# EAGLE design MLS01-TG000-C09 (EAGLE 9.6.2)
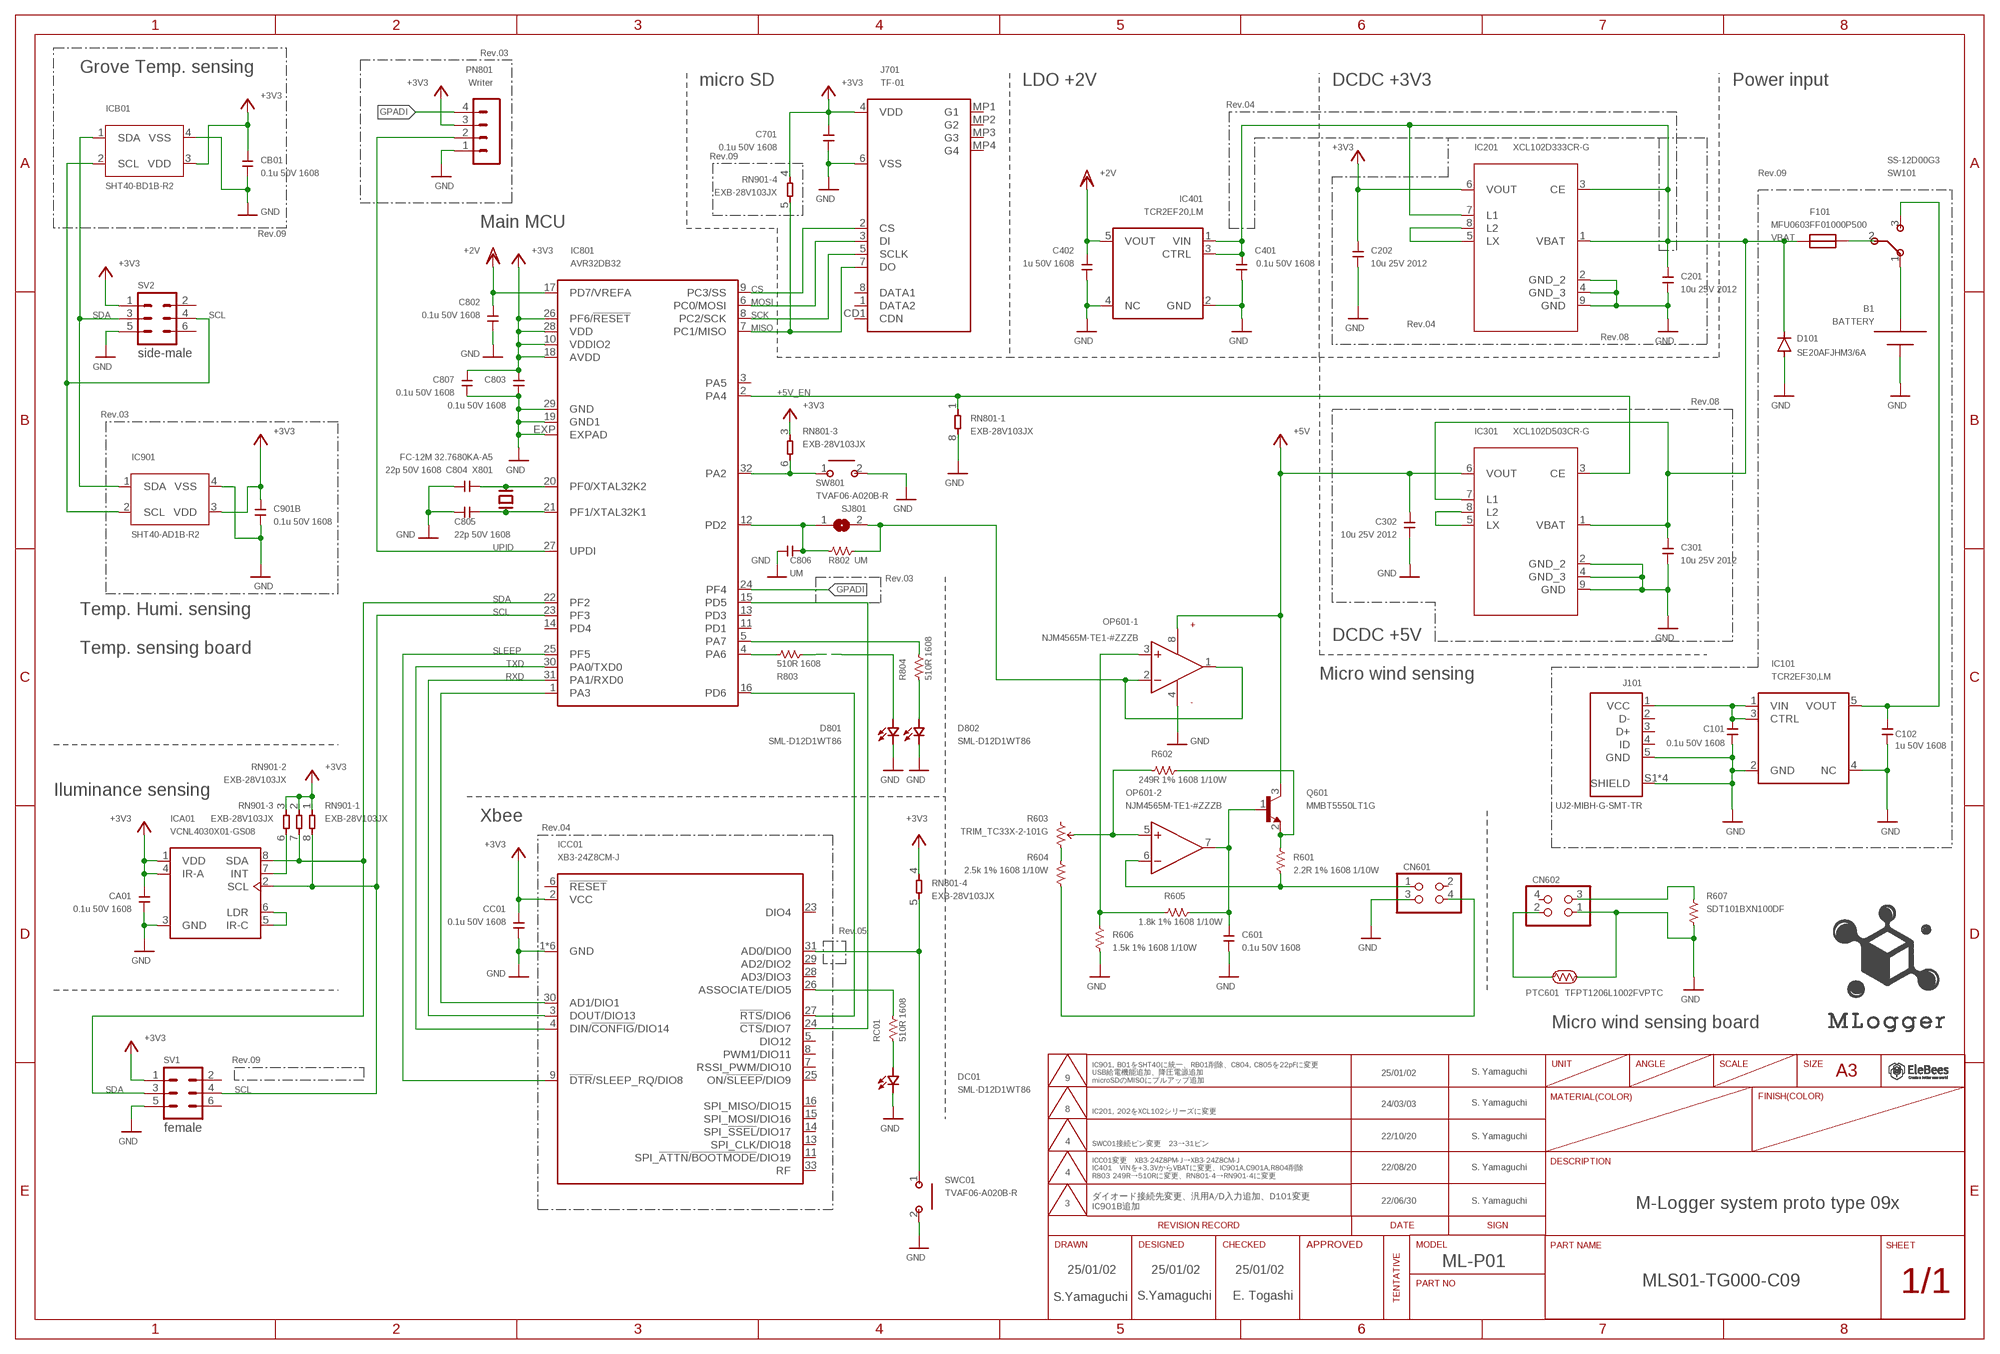
[diagram p0: schematic, sheet 1]

## Parts
B1  BATTERY  [PAD]
C101  0.1u 50V 1608  CL10A105KP8NNNC  [C-1608/0603]
C102  1u 50V 1608  CL10A105KP8NNNC  [C-1608/0603]
C201  10u 25V 2012  CL21B105KBFNNNG  [C-2012/0805]
C202  10u 25V 2012  CL21B105KBFNNNG  [C-2012/0805]
C301  10u 25V 2012  CL21B105KBFNNNG  [C-2012/0805]
C302  10u 25V 2012  CL21B105KBFNNNG  [C-2012/0805]
C401  0.1u 50V 1608  CL10A105KP8NNNC  [C-1608/0603]
C402  1u 50V 1608  CL10A105KP8NNNC  [C-1608/0603]
C601  0.1u 50V 1608  CL10A105KP8NNNC  [C-1608/0603]
C701  0.1u 50V 1608  CL10A105KP8NNNC  [C-1608/0603]
C802  0.1u 50V 1608  CL10A105KP8NNNC  [C-1608/0603]
C803  0.1u 50V 1608  CL10A105KP8NNNC  [C-1608/0603]
C804  22p 50V 1608  CL10A105KP8NNNC  [C-1608/0603]
C805  22p 50V 1608  CL10A105KP8NNNC  [C-1608/0603]
C806  UM  CL10A105KP8NNNC  [C-1608/0603]
C807  0.1u 50V 1608  CL10A105KP8NNNC  [C-1608/0603]
C901B  0.1u 50V 1608  CL10A105KP8NNNC  [C-1608/0603]
CA01  0.1u 50V 1608  CL10A105KP8NNNC  [C-1608/0603]
CB01  0.1u 50V 1608  CL10A105KP8NNNC  [C-1608/0603]
CC01  0.1u 50V 1608  CL10A105KP8NNNC  [C-1608/0603]
CN601  PINHD-2X2  [2X02]
CN602  PINHD-2X2  [2X02]
D101  SE20AFJHM3/6A  GS2JFL-TP  [SODFL5629X125N]
D801  SML-D12D1WT86  [SMD-1608]
D802  SML-D12D1WT86  [SMD-1608]
DC01  SML-D12D1WT86  [SMD-1608]
F101  MFU0603FF01000P500  [FUSC1608X60N]
IC101  TCR2EF30,LM  TCR2EF20,LM  [SOT23-5L]
IC201  XCL102D333CR-G  XCL102D503CR-GCL-2025-02_TOR  [CL-2025-02_TOR]
IC301  XCL102D503CR-G  XCL102D503CR-GCL-2025-02_TOR  [CL-2025-02_TOR]
IC401  TCR2EF20,LM  [SOT23-5L]
IC801  AVR32DB32  [HVQFN32]
IC901  SHT40-AD1B-R2  SHT41  [SHT41]
ICA01  VCNL4030X01-GS08  [VISHAY_VCNL4030X01-GS08]
ICB01  SHT40-BD1B-R2  SHT41  [SHT41]
ICC01  XB3-24Z8CM-J  [XCVR_XB3-24Z8CM-J]
J101  UJ2-MIBH-G-SMT-TR  [CUI_UJ2-MIBH-G-SMT-TR]
J701  TF-01  [TF-01A]
OP601  NJM4565M-TE1-#ZZZB  [SOIC127P680X175-8N]
PN801  Writer  MA04-1  [MA04-1]
PTC601  TFPT1206L1002FVPTC  [C1206]
Q601  MMBT5550LT1G  [SOT95P237X111-3N]
R601  2.2R 1% 1608 1/10W  R-1608  [R-1608/0603]
R602  249R 1% 1608 1/10W  R-1608  [R-1608/0603]
R603  TRIM_TC33X-2-101G  [TRIM_TC33X-2-101G]
R604  2.5k 1% 1608 1/10W  R-1608  [R-1608/0603]
R605  1.8k 1% 1608 1/10W  R-1608  [R-1608/0603]
R606  1.5k 1% 1608 1/10W  R-1608  [R-1608/0603]
R607  SDT101BXN100DF  [SDT101BXN100DF]
R802  UM  R-1608  [R-1608/0603]
R803  510R 1608  R-1608  [R-1608/0603]
R804  510R 1608  R-1608  [R-1608/0603]
RC01  510R 1608  R-1608  [R-1608/0603]
RN801  EXB-28V103JX  [RESCAXS50P200X100X45-8N]
RN901  EXB-28V103JX  [RESCAXS50P200X100X45-8N]
SJ801  SJ  [SJ]
SV1  female  MA03-2-FEMALE  [MA03-2-FEMALE]
SV2  side-male  MA03-2-SIDE-MALE  [MA03-2-SIDE-MALE]
SW101  SS-12D00G3  [SS-12D00G3]
SW801  TVAF06-A020B-R  [TVAF06-A020B-R]
SWC01  TVAF06-A020B-R  [TVAF06-A020B-R]
U$4  ELEBEES_SMALL  [ELEBEES_SMALL]
X801  FC-12M 32.7680KA-A5  SMD-CRYSTAL-32.768KHZ-12.5PF-20PPM-90K(2P-L2.0X1.2MM)  [X2-SMD-L2.0X1.2X0.55MM]

## Nets
+2V [PWR]: C402.P$1 C802.P$1 IC401.5(VOUT) IC801.17(PD7/VREFA)
+3V3: C202.P$2 C701.P$1 C803.P$1 C807.P$1 C901B.P$1 CA01.P$1 CB01.P$1 CC01.P$1 IC201.6(VOUT) IC801.10(VDDIO2) IC801.18(AVDD) IC801.26(PF6/!RESET) IC801.28(VDD) IC901.3(VDD) ICA01.1(VDD) ICA01.4(IR-A) ICB01.3(VDD) ICC01.2(VCC) J701.4(VDD) PN801.3 RN801.3 RN801.4 RN901.1 RN901.2 RN901.3 RN901.4 SV1.1 SV2.1
+5V: C302.P$2 IC301.6(VOUT) OP601.8(-1:V+) Q601.3(C)
+5V_EN: IC301.3(CE) IC801.2(PA4) RN801.1
BAT: B1.1(+) SW101.1
CS: IC801.9(PC3/SS) J701.2(CS)
GND: B1.2(-) C101.P$2 C102.P$2 C201.P$1 C202.P$1 C301.P$1 C302.P$1 C401.P$2 C402.P$2 C601.P$2 C701.P$2 C802.P$2 C803.P$2 C804.P$2 C805.P$2 C806.P$2 C807.P$2 C901B.P$2 CA01.P$2 CB01.P$2 CC01.P$2 CN601.3 CN602.1 D101.2(A) D801.2(C) D802.2(C) DC01.2(C) IC101.2(GND) IC101.4(NC) IC201.2(GND_2) IC201.4(GND_3) IC201.9(GND) IC301.2(GND_2) IC301.4(GND_3) IC301.9(GND) IC401.2(GND) IC401.4(NC) IC801.19(GND1) IC801.29(GND) IC801.EXP(EXPAD) IC901.4(VSS) ICA01.3(GND) ICB01.4(VSS) ICC01.1(GND) ICC01.10(GND) ICC01.12(GND) ICC01.21(GND) ICC01.32(GND) ICC01.34(GND) J101.5(GND) J101.S1(SHIELD) J101.S2(SHIELD) J101.S3(SHIELD) J101.S4(SHIELD) J701.6(VSS) OP601.4(-1:V-) PN801.1 PTC601.1 R606.1 R607.1 RN801.8 SV1.5 SV2.5 SW801.2 SWC01.2
GPADI: IC801.24(PF4) PN801.4
MISO: IC801.7(PC1/MISO) J701.7(DO) RN901.5
MOSI: IC801.6(PC0/MOSI) J701.3(DI)
N$1: F101.1 SW101.2
N$3: CN601.4 CN602.2 PTC601.2 R604.1
N$6: IC201.5(LX) IC201.8(L2)
N$8: IC301.5(LX) IC301.8(L2)
N$9: IC801.5(PA7) R804.2
N$10: D802.1(A) R804.1
N$11: OP601.1(-1:OUT) OP601.2(-1:-IN) R802.2 SJ801.2
N$12: ICC01.26(ASSOCIATE/DIO5) RC01.2
N$13: DC01.1(A) RC01.1
N$15: OP601.3(-1:+IN) R605.1 R606.2
N$16: OP601.5(-2:+IN) R602.1 R603.2
N$17: R603.3 R604.2
N$18: IC801.4(PA6) R803.1
N$19: C601.P$1 OP601.7(-2:OUT) Q601.1(B) R605.2
N$20: CN601.1 CN602.3 OP601.6(-2:-IN) R601.1 R607.2
N$21: IC801.1(PA3) ICC01.30(AD1/DIO1)
N$22: IC801.15(PD5) ICC01.24(!CTS!/DIO7)
N$23: IC801.16(PD6) ICC01.27(!RTS!/DIO6)
N$24: C101.P$1 IC101.1(VIN) IC101.3(CTRL) J101.1(VCC)
N$25: C806.P$1 IC801.12(PD2) R802.1 SJ801.1
N$30: Q601.2(E) R601.2 R602.2
N$31: ICA01.7(INT) RN901.6
N$39: D801.1(A) R803.2
N$49: IC801.32(PA2) RN801.6 SW801.1
N$50: C804.P$1 IC801.20(PF0/XTAL32K2) X801.1
N$51: C805.P$1 IC801.21(PF1/XTAL32K1) X801.2
N$56: ICC01.31(AD0/DIO0) RN801.5 SWC01.1
N$57: ICA01.5(IR-C) ICA01.6(LDR)
RXD: IC801.31(PA1/RXD0) ICC01.3(DOUT/DIO13)
SCK: IC801.8(PC2/SCK) J701.5(SCLK)
SCL: IC801.23(PF3) IC901.2(SCL) ICA01.2(SCL) ICB01.2(SCL) RN901.8 SV1.4 SV2.4
SDA: IC801.22(PF2) IC901.1(SDA) ICA01.8(SDA) ICB01.1(SDA) RN901.7 SV1.3 SV2.3
SLEEP: IC801.25(PF5) ICC01.9(!DTR!/SLEEP_RQ/DIO8)
TXD: IC801.30(PA0/TXD0) ICC01.4(DIN/!CONFIG!/DIO14)
UPID: IC801.27(UPDI) PN801.2
USB: C102.P$1 IC101.5(VOUT) SW101.3
VBAT: C201.P$2 C301.P$2 C401.P$1 D101.1(C) F101.2 IC201.1(VBAT) IC201.3(CE) IC201.7(L1) IC301.1(VBAT) IC301.7(L1) IC401.1(VIN) IC401.3(CTRL)
Unconnected: CN601.2 CN602.4 IC801.3(PA5) IC801.11(PD1) IC801.13(PD3) IC801.14(PD4) ICC01.5(DIO12) ICC01.6(!RESET) ICC01.7(RSSI_PWM/DIO10) ICC01.8(PWM1/DIO11) ICC01.11(SPI_!ATTN!/!BOOTMODE!/DIO19) ICC01.13(SPI_CLK/DIO18) ICC01.14(SPI_!SSEL!/DIO17) ICC01.15(SPI_MOSI/DIO16) ICC01.16(SPI_MISO/DIO15) ICC01.23(DIO4) ICC01.25(ON/!SLEEP!/DIO9) ICC01.28(AD3/DIO3) ICC01.29(AD2/DIO2) ICC01.33(RF) J101.2(D-) J101.3(D+) J101.4(ID) J701.1(DATA2) J701.8(DATA1) J701.CD1(CDN) J701.MP1(G1) J701.MP2(G2) J701.MP3(G3) J701.MP4(G4) R603.1 RN801.2 RN801.7 SV1.2 SV1.6 SV2.2 SV2.6

## Notes on the sheet
- Rev.03
- Grove Temp. sensing
- micro SD | LDO +2V | DCDC +3V3 | Power input
- Rev.04
- Rev.09
- Rev.09
- Main MCU
- Rev.09
- Rev.04
- Rev.08
- Rev.08
- Rev.03
- Rev.03
- Temp. Humi. sensing
- DCDC +5V
- Temp. sensing board
- Micro wind sensing
- Iluminance sensing
- Xbee
- Rev.04
- Rev.05
- Micro wind sensing board
- Rev.09
- 25/01/02 | S. Yamaguchi
- 9
- IC901, B01をSHT40に統一、RB01削除、C804, C805を22pFに変更
  USB給電機能追加、降圧電源追加
  microSDのMISOにプルアップ追加
- 24/03/03 | S. Yamaguchi
- 8 | IC201, 202をXCL102シリーズに変更
- 22/10/20 | S. Yamaguchi
- 4 | SWC01接続ピン変更　23→31ピン
- 22/08/20 | S. Yamaguchi
- 4
- ICC01変更　XB3-24Z8PM-J→XB3-24Z8CM-J
  IC401　VINを+3.3VからVBATに変更、IC901A,C901A,R804削除　
  R803 249R→510Rに変更、RN801-4→RN901-4に変更
- 3 | 22/06/30 | S. Yamaguchi
- ダイオード接続先変更、汎用A/D入力追加、D101変更
  IC901B追加
- M-Logger system proto type 09x
- ML-P01
- 25/01/02 | 25/01/02 | 25/01/02
- MLS01-TG000-C09
- S.Yamaguchi | S.Yamaguchi | E. Togashi

## Library data of the parts
B1 = yamaguchi:BATTERY
C101 C102 C401 C402 C601 C701 C802-C807 C901B CA01 CB01 CC01 = yamaguchi:CL10A105KP8NNNC
C201 C202 C301 C302 = yamaguchi:CL21B105KBFNNNG
CN601 CN602 = yamaguchi:PINHD-2X2: PIN HEADER
D101 = yamaguchi:GS2JFL-TP
D801 D802 DC01 = yamaguchi:SML-D12D1WT86
F101 = yamaguchi:MFU0603FF01000P500
IC101 IC401 = yamaguchi:TCR2EF20,LM
IC201 IC301 = yamaguchi:XCL102D503CR-G; BUILT_BY: EMA_Cory; COPYRIGHT: Copyright (C) 2021 Accelerated Designs. All rights reserved; DATASHEET: https://www.torexsemi.com/file/xcl102/XCL102-103.pdf; MANUFACTURER_PART_NUMBER: XCL102D503CR-G; RS_PART_NUMBER_1: 893-1381-2-ND; RS_PART_NUMBER_2: 893-1381-1-ND; RS_PART_NUMBER_3: 893-1381-6-ND; SOURCELIBRARY: Add_to_database_2022-04-06; VENDOR: Torex Semiconductor
IC801 = yamaguchi:AVR32DB32
IC901 ICB01 = yamaguchi:SHT41
ICA01 = yamaguchi:VCNL4030X01-GS08: VCNL4030 Fully Integrated Proximity and Ambient Light Sensor with Infrared Emitter, I2C Interface, and Interrupt Function: VCNL4030X01 integrates a proximity sensor (PS), ambient light sensor (ALS), and a high power IRED into one small package. It incorporates photodiodes, amplifiers, and analog to digital converting circuits into a single chip by CMOS process. The 16-bit high resolution ALS offers excellent sensing capabilities with sufficient selections to fulfill most applications whether dark or high transparency lens design. Both ALS and PS programmable interrupt features of individual high and low thresholds offers the best utilization of resource and power saving on the microcontroller. Device Model created 15.06.2016 by Johannes Kolb - Vishay Semiconductor GmbH Check availability; AVAILABILITY: In Stock; DESCRIPTION: Proximity + Ambient Light Sensor, I²C Interface, 4 Slave Addresses; MF: Vishay; MP: VCNL4030X01-GS08; PACKAGE: QFN-8 Vishay; PRICE: None; PURCHASE-URL: https://pricing.snapeda.com/search/part/VCNL4030X01-GS08/?ref=eda
ICC01 = yamaguchi:XB3-24Z8CM-J: XBee3, 2.4 GHz ZB 3.0, Chip Ant, MMT Check availability; AVAILABILITY: In Stock; DESCRIPTION: 802.15.4 Zigbee® Transceiver Module 2.4GHz Integrated, Chip Surface Mount; MF: Digi International; MP: XB3-24Z8CM-J; PACKAGE: SMD-34 Digi International; PRICE: None; PURCHASE-URL: https://pricing.snapeda.com/search/part/XB3-24Z8CM-J/?ref=eda
J101 = yamaguchi:UJ2-MIBH-G-SMT-TR: USB micro B type receptacle; MANUFACTURER: CUI; MAXIMUM_PACKAGE_HEIGHT: 2.95 mm; PARTREV: 1.0; STANDARD: Manufacturer Recommendations
J701 = yamaguchi:TF-01
OP601 = yamaguchi:NJM4565M-TE1-#ZZZB
PN801 = yamaguchi:MA04-1: PIN HEADER; OC_FARNELL: unknown; OC_NEWARK: unknown
PTC601 = yamaguchi:TFPT1206L1002FV
Q601 = yamaguchi:MMBT5550LT1G
R601 R602 R604-R606 R802-R804 RC01 = yamaguchi:R-1608: R 1608/0603
R603 = yamaguchi:TRIM_TC33X-2-101G
R607 = yamaguchi:SDT101BXN100DF
RN801 RN901 = yamaguchi:EXB-28V103JX
SJ801 = yamaguchi:SJ: SMD solder JUMPER
SV1 = yamaguchi:MA03-2-FEMALE: PIN HEADER; OC_FARNELL: unknown; OC_NEWARK: unknown
SV2 = yamaguchi:MA03-2-SIDE-MALE: PIN HEADER; OC_FARNELL: unknown; OC_NEWARK: unknown
SW101 = yamaguchi:SS-12D00G3
SW801 SWC01 = yamaguchi:TVAF06-A020B-R
U$4 = yamaguchi:ELEBEES_SMALL
X801 = yamaguchi:SMD-CRYSTAL-32.768KHZ-12.5PF-20PPM-90K(2P-L2.0X1.2MM): 306010020 Check availability; AVAILABILITY: In Stock; DESCRIPTION: 32.768 kHz ±30ppm Crystal 12.5pF 90 kOhms 2-SMD, No Lead; MF: EPSON; MP: FC-12M; PACKAGE: SMD-2 EPSON; PRICE: None; PURCHASE-URL: https://pricing.snapeda.com/search/part/FC-12M/?ref=eda

## Net classes
0 default: width 0.127 mm
1 GND: width 0.127 mm
2 PWR: width 0.127 mm

## Board
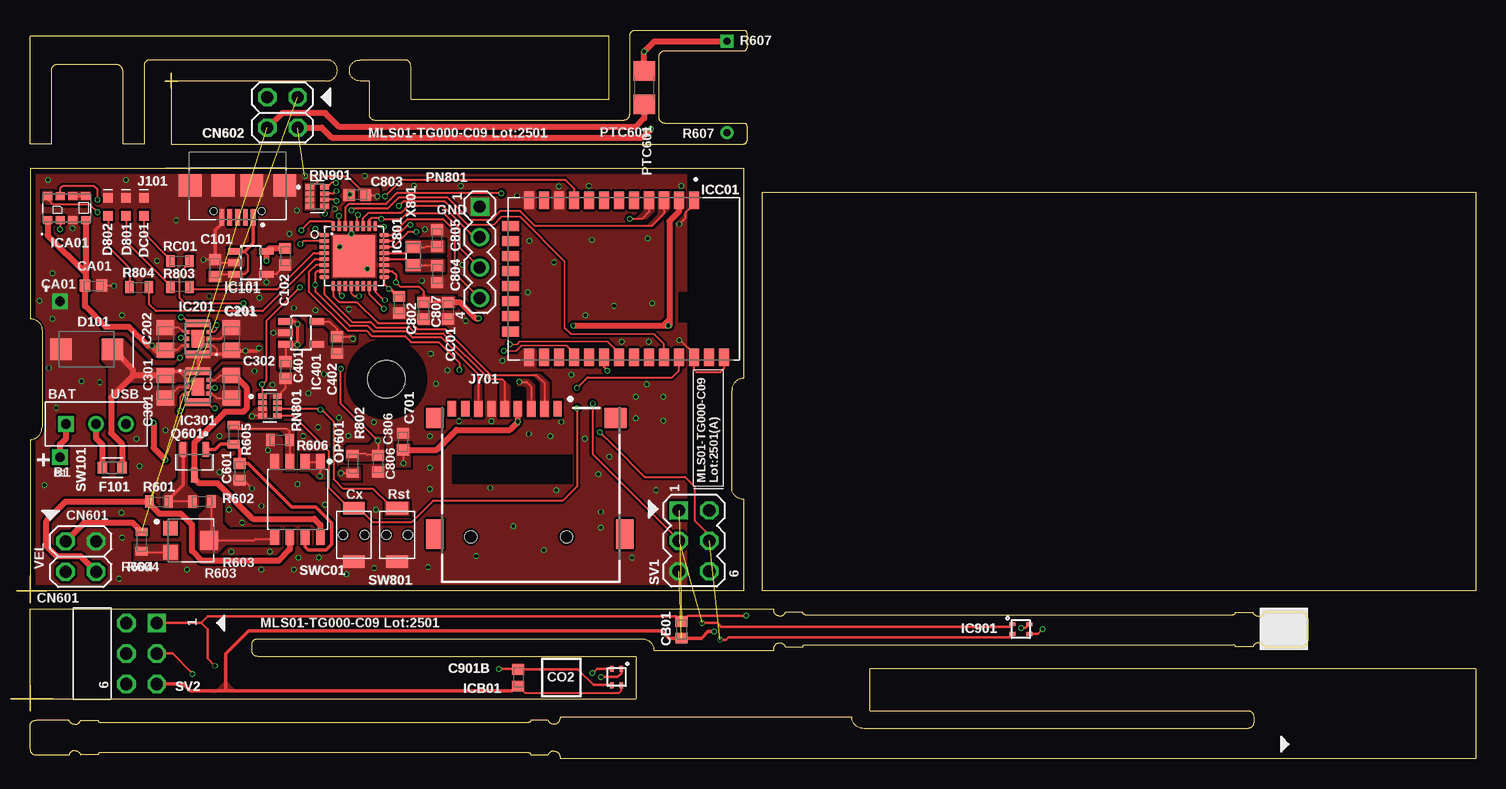
[diagram p1: board, top side]
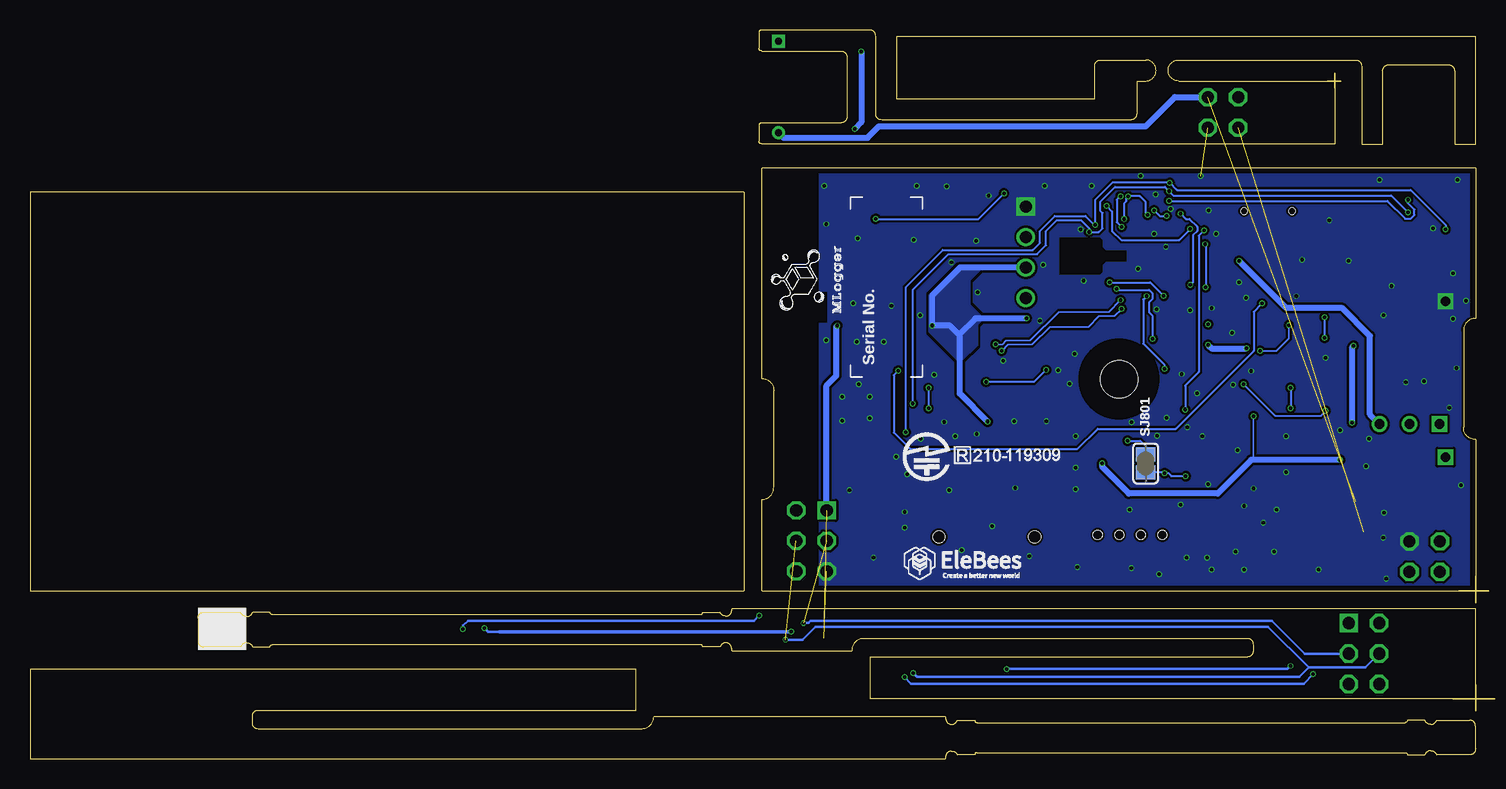
[diagram p2: board, bottom side, seen from below]

Size 120.5 x 60.75 mm. Coordinates in mm from the lower left corner, seen from the top.
Outline: 134 segments
Copper layers (1*16): Top 0.035mm / dielectric 1.2mm / Bottom 0.035mm
Design rules "jlcpcb-2layers-custom *": minimum track width 5mil, minimum drill 0.3mm, track to track 0.205mm, track to pad 0.205mm, pad to pad 0.205mm, via to via 0.205mm, smd to smd 5mil, copper to edge 0.2mm, drill to drill 6mil, minimum pad ring 10mil, minimum via ring 3mil, stop-mask expansion 0.002540625mm, vias tented up to drill 0.5mm, thermal gap 10mil
Holes 3.1 mm at 29.72,31.64
tKeepout: area 9.5,42.2 to 11.5,49.2; area 0,42.2 to 10.5,44.2
tRestrict: area 26.4,28.3 to 33,34.9; 13 lines
bRestrict: area 26.4,28.3 to 33,34.9; area 29.1,40.4 to 34.6,43.5; area 54.1,36.4 to 54.8,38.9
Milling: 6 lines

### Footprints (pad centres in the part's own frame; a part is rotated, then mirrored left to right if it is on the bottom)
PAD = drill 0.8 square: 1 0,-6.5; 2 0,6.5
C-1608/0603 = smd 0.9 x 1: P$1 -0.7,0; P$2 0.7,0
C-2012/0805 = smd 1.25 x 1.45: P$1 -0.95,0; P$2 0.95,0
2X02 = drill 1.016 octagon: 1 -1.27,-1.27; 2 -1.27,1.27; 3 1.27,-1.27; 4 1.27,1.27
SODFL5629X125N = smd 1.812 x 1.762: 1 -2.15,0; 2 2.15,0
SMD-1608 = smd 0.8 x 0.8: 1 -0.75,0; 2 0.75,0
FUSC1608X60N = smd 0.799 x 0.974: 1 -0.815,0; 2 0.815,0
SOT23-5L = smd 0.55 x 1.2: 1 -0.95,-1.3; 2 0,-1.3; 3 0.95,-1.3; 4 0.95,1.3; 5 -0.95,1.3
CL-2025-02_TOR = smd 0.254 x 0.34: 1 -0.855,0.55; 2 -0.855,0; 3 -0.855,-0.55; 4 0.855,-0.55; 5 0.855,0; 6 0.855,0.55 | smd 2.057 x 0.635: 7 0,1.283; 8 0,-1.283 | smd 1.041 x 1.473: 9 0,0
HVQFN32 = smd 0.8 x 0.3: 1 -2.5,1.75; 2 -2.5,1.25; 3 -2.5,0.75; 4 -2.5,0.25; 5 -2.5,-0.25; 6 -2.5,-0.75; 7 -2.5,-1.25; 8 -2.5,-1.75; 17 2.5,-1.75; 18 2.5,-1.25; 19 2.5,-0.75; 20 2.5,-0.25; 21 2.5,0.25; 22 2.5,0.75; 23 2.5,1.25; 24 2.5,1.75 | smd 0.3 x 0.8: 9 -1.75,-2.5; 10 -1.25,-2.5; 11 -0.75,-2.5; 12 -0.25,-2.5; 13 0.25,-2.5; 14 0.75,-2.5; 15 1.25,-2.5; 16 1.75,-2.5; 25 1.75,2.5; 26 1.25,2.5; 27 0.75,2.5; 28 0.25,2.5; 29 -0.25,2.5; 30 -0.75,2.5; 31 -1.25,2.5; 32 -1.75,2.5 | smd 3.5 x 3.5: EXP 0,0 | smd 0.25 x 0.25: M1 -2.415,2.415
SHT41 = smd 0.5 x 0.3: 1 -0.7,0.4; 2 -0.7,-0.4; 3 0.7,-0.4; 4 0.7,0.4
VISHAY_VCNL4030X01-GS08 = smd 0.65 x 0.75: 1 -1.005,1.575; 2 -1.005,0.525; 3 -1.005,-0.525; 4 -1.005,-1.575; 5 1.005,-1.575; 6 1.005,-0.525; 7 1.005,0.525; 8 1.005,1.575
XCVR_XB3-24Z8CM-J = smd 1.448 x 0.838: 1 -6.553,5.842; 2 -6.553,4.592; 3 -6.553,3.343; 4 -6.553,2.093; 5 -6.553,0.843; 6 -6.553,-0.406; 7 -6.553,-1.656; 8 -6.553,-2.906; 9 -6.553,-4.155; 10 -6.553,-5.405; 11 -6.553,-6.655; 12 -6.553,-7.904; 21 6.553,-7.904; 22 6.553,-6.655; 23 6.553,-5.405; 24 6.553,-4.155; 25 6.553,-2.906; 26 6.553,-1.656; 27 6.553,-0.406; 28 6.553,0.843; 29 6.553,2.093; 30 6.553,3.343; 31 6.553,4.592; 32 6.553,5.842; 33 6.553,7.092; 34 6.553,8.357 | smd 0.838 x 1.448: 13 -4.381,-9.436; 14 -3.132,-9.436; 15 -1.882,-9.436; 16 -0.632,-9.436; 17 0.617,-9.436; 18 1.867,-9.436; 19 3.117,-9.436; 20 4.381,-9.436
CUI_UJ2-MIBH-G-SMT-TR = smd 0.4 x 1.35: 1 -1.3,2.675; 2 -0.65,2.675; 3 0,2.675; 4 0.65,2.675; 5 1.3,2.675 | smd 1.9 x 1.9: S1 -3.95,0; S2 -1.2,0; S3 1.2,0; S4 3.95,0 | hole 0.55: -2,2.15; 2,2.15
TF-01A = smd 0.7 x 1.3: 1 2.23,7.174; 2 1.13,7.174; 3 0.03,7.174; 4 -1.07,7.174; 5 -2.17,7.174; 6 -3.27,7.174; 7 -4.37,7.174; 8 -5.47,7.174; CD1 -6.57,7.174 | smd 1.448 x 1.651: MP1 -7.989,6.4 | smd 1.448 x 2.438: MP2 -7.989,-3.3; MP3 7.836,-3.3 | smd 1.854 x 1.651: MP4 7.061,6.4 | hole 1: -5.004,-3.531; 2.972,-3.531
SOIC127P680X175-8N = smd 1.3 x 0.72: 1 -3.15,1.905; 2 -3.15,0.635; 3 -3.15,-0.635; 4 -3.15,-1.905; 5 3.15,-1.905; 6 3.15,-0.635; 7 3.15,0.635; 8 3.15,1.905
MA04-1 = drill 1.016 square: 1 -3.81,0 | drill 1.016: 2 -1.27,0; 3 1.27,0; 4 3.81,0
C1206 = smd 1.6 x 1.8: 1 -1.4,0; 2 1.4,0
SOT95P237X111-3N = smd 1.23 x 0.6: 1 -1.06,0.95; 2 -1.06,-0.95; 3 1.06,0
R-1608/0603 = smd 0.7 x 1: 1 -0.8,0; 2 0.8,0
TRIM_TC33X-2-101G = smd 1.2 x 1.2: 1 -1.8,1; 3 -1.8,-1 | smd 1.5 x 1.6: 2 1.45,0
SDT101BXN100DF = drill 0.6 square: 1 -3.81,0 | drill 0.6: 2 3.81,0
RESCAXS50P200X100X45-8N = smd 0.79 x 0.44: 1 -0.62,0.8; 4 -0.62,-0.8; 5 0.62,-0.8; 8 0.62,0.8 | smd 0.79 x 0.34: 2 -0.62,0.25; 3 -0.62,-0.25; 6 0.62,-0.25; 7 0.62,0.25
SJ = smd 1.168 x 1.6: 1 -0.762,0; 2 0.762,0
MA03-2-FEMALE = drill 1.016 square: 1 -2.54,-1.27 | drill 1.016 octagon: 2 -2.54,1.27; 3 0,-1.27; 4 0,1.27; 5 2.54,-1.27; 6 2.54,1.27
MA03-2-SIDE-MALE = drill 1.016 square: 1 -2.54,1.27 | drill 1.016 octagon: 2 -2.54,-1.27; 3 0,1.27; 4 0,-1.27; 5 2.54,1.27; 6 2.54,-1.27
SS-12D00G3 = drill 0.8 square: 1 -2.5,0 | drill 0.8: 2 0,0; 3 2.5,0
TVAF06-A020B-R = smd 1.05 x 1.8: 1 -2.225,0; 2 2.225,0 | hole 0.75: 0,0.9; 0,-0.9
X2-SMD-L2.0X1.2X0.55MM = smd 1 x 1.25: 1 -0.75,0; 2 0.75,0

### Placement (x,y rotation side)
B1  2.5,31.62 0 top
C101  15.44,40.9 90 top
C102  21.29,41.85 270 top
C201  16.8,35 270 top
C202  11.3,35 270 top
C301  11.3,31 90 top
C302  16.8,31 90 top
C401  21.3,32.4 270 top
C402  25.6,34.5 270 top
C601  17.47,23.91 270 top
C701  31.12,26.43 90 top
C802  30.75,37.85 270 top
C803  27.3,47 180 top
C804  33.95,40.4 270 top
C805  33.95,43.4 90 top
C806  29,24.6 270 top
C807  32.81,37.35 270 top
C901B  40.7,6.75 270 top
CA01  5.29,39.43 0 top
CB01  54.31,10.74 270 top
CC01  34.85,37.35 270 top
CN601  4.24,16.84 90 top
CN602  21.05,53.88 90 top
D101  4.73,34.13 180 top
D801  8,46 90 top
D802  6.5,46 90 top
DC01  9.5,46 90 top
F101  6.86,24.25 0 top
IC101  18.4,41.34 270 top
IC201  14,35 180 top
IC301  14,31 0 top
IC401  22.6,35.5 270 top
IC801  27.03,41.9 0 top
IC901  82.6,10.8 0 top
ICA01  3.05,45.9 90 top
ICB01  48.9,6.8 270 top
ICC01  49.5,40 270 top
J101  17.3,47.8 180 top
J701  41.75,22 0 top
OP601  22.3,21.6 270 top
PN801  37.49,42.21 270 top
PTC601  51.2,55.94 270 top
Q601  13.7,24.7 270 top
R601  10.76,21.42 0 top
R602  14.34,21.43 180 top
R603  13.5,18.2 0 top
R604  9.3,18.1 270 top
R605  16.97,27.01 270 top
R606  20.83,26.58 0 top
R607  58.1,56 270 top
R802  26.9,24.6 270 top
R803  12.5,39.32 180 top
R804  9.1,39.3 0 top
RC01  12.5,41.5 0 top
RN801  20,29.4 0 top
RN901  23.95,46.85 0 top
SJ801  27.5,24.6 270 bottom
SV1  55.36,18.15 270 top
SV2  9.3,8.75 270 top
SW101  5.5,27.9 0 top
SW801  30.6,18.65 270 top
SWC01  27,18.65 270 top
U$2  [SERIAL_NO]  52.1,31.8 90 bottom
U$3  [MLOGGER_LOGO]  52.1,35.9 90 bottom
U$4  48,14.75 0 bottom
X801  31.95,41.9 90 top

### Tracks (layer width: path | path; a pad name or v marks a point on that pad's centre or on a via)
+2V  (via drill 0.3)
  Top 0.152: IC801.17 29.53,39.57 30.55,38.55 C802.P$1 30.14,39.16 v29.9,39.16 | IC401.5 24.95,36.45 25.6,35.8 C402.P$1 26.7,35.2 v26.9,35
  Bottom 0.152: v26.9,35 26.9,36.9 27.2,37.2 27.2,38.04 26.9,38.34 26.9,38.78 27.2,39.08 29.82,39.08 v29.9,39.16
  pour Top (no thermals): 23.3,36.1 24.6,36.1 25,35.7 25,34.7 27.1,34.7 27.2,34.8 27.2,35.2 27.1,35.3 26.4,35.3 25,36.7 23.3,36.7
+3V3  (via drill 0.3)  (1 unrouted)
  Top 0.127: RN801.3 RN801.4 18.57,28.6 v18.51,28.54
  Top 0.152: C701.P$1 v31.12,24.63 | IC801.18 30.2,40.65 30.51,40.34 v30.51,39.71 v30.5,39.7 30.86,39.35 32.45,39.35 32.81,38.99 C807.P$1 CC01.P$1 | v28.94,46.89 28.83,47 C803.P$1 26.46,48.54 24.39,48.54 23.5,47.65 RN901.1 RN901.2 RN901.3 RN901.4 | IC801.26 28.28,44.92 28.44,45.08 29.19,45.08 v29.29,44.98 30.92,44.98 31.43,45.5 34.48,45.5 35.8,44.19 35.8,42.6 37.46,40.94 PN801.3 | IC801.28 27.28,45.28 v27.34,45.34 | IC801.10 25.78,38.77 v25.98,38.57 | SV2.1 10.59,11.31 | C202.P$2 11.25,34.1 11.2,34.1 | 54.41,11.44 CB01.P$1 54.21,11.44 | CA01.P$1 4.8,39.22 4.8,39.17 | IC201.6 13.16,34.45
  Top 0.2: 10.59,11.31 14.27,11.31 | 54.21,11.44 53.81,11.84 14.8,11.84 14.27,11.31 | C202.P$2 12.25,34.05 12.65,34.45 13.16,34.45 | 14.27,11.31 14.8,10.77 14.8,8.35 15.4,7.75 v15.4,7.73 | 54.41,11.44 54.87,11.9 59.69,11.9 v59.72,11.93 | v39.08,7.46 C901B.P$1 45.65,7.45 46.97,6.13 48.47,6.13 ICB01.3 | v84.4,10.8 84,10.4 IC901.3
  Top 0.508: ICC01.2 54.09,45.59 53.3,44.8 53.3,36.6 | 53.3,36.6 53.3,36.1 v53.2,36.1 52.8,36.1 | v45.3,36.1 52.8,36.1 | C701.P$1 33.88,25.73 35.55,27.4 40,27.4 40.68,28.08 v40.68,28.1 J701.4 | CC01.P$1 35.85,38.05 37.2,36.7 v37.4,36.7 | 1.49,44.88 ICA01.1 1.48,43.61 4.62,40.47 | 52.8,36.1 53.3,36.6 | v10.3,28 10.3,25.9 v11.3,24.9 | C202.P$2 11.25,34 10.57,34 v10.15,34.42 9.85,34.42 8.27,36 6.3,36 4.59,37.71 CA01.P$1 4.62,39.47 4.62,40.47 | ICA01.4 4.62,40.47
  Bottom 0.127: v18.51,28.54 18.51,25.11 18.3,24.9
  Bottom 0.152: v29.29,44.98 29.29,46.3 29.09,46.5 29.09,46.74 v28.94,46.89 27.99,46.89 27.5,46.4 27.5,45.5 v27.34,45.34 | v25.98,38.57 27.12,39.7 v30.5,39.7
  Bottom 0.2: v15.4,7.73 15.67,7.46 v39.08,7.46 | v59.72,11.93 60.15,11.5 84,11.5 84.4,11.1 v84.4,10.8
  Bottom 0.508: PN801.3 42.96,40.94 45.3,38.6 v45.3,36.1 43.8,36.1 43.05,35.35 | v11.3,24.9 18.3,24.9 18.7,24.9 21.5,22.1 28.9,22.1 31.12,24.32 v31.12,24.63 | v40.68,28.1 43,30.42 43,35.3 43.05,35.35 | v37.4,36.7 41.7,36.7 43.05,35.35 | SV1.1 54.09,31.11 53.3,31.9 53.3,36 v53.2,36.1 | v10.15,34.42 10.3,34.27 v10.3,28
  pour Top (no thermals): 35.45,38.55 35.45,37.55 32.31,37.55 32.31,38.55 32.55,38.55 32.8,38.8 33.05,38.55
  pour Top (no thermals): 31.72,26.23 30.52,26.23 30.52,24.33 31.72,24.33
  pour Top (no thermals): 22.88,45.72 23.8,45.72 23.8,47.96 22.88,47.96
  pour Top (no thermals): 27.4,47.6 29,47.6 29.12,47.48 29.12,46.61 29.01,46.5 27.5,46.5 27.4,46.6
  pour Bottom (no thermals): 41.2,36.9 42.1,37.8 42.1,39.9 40.86,41.14 43.05,41.14 45.6,38.59 45.6,35.6 43.2,33.2 42.8,33.2 41.5,34.5 41.5,36.2 41.2,36.5
  pour Top (no thermals): 18.85,29.28 19.76,29.28 19.76,28.35 19.69,28.28 18.31,28.28 18.24,28.35 18.24,28.67
  pour Top (no thermals): 10.55,33.45 12,33.45 12.87,34.32 13.25,34.32 13.25,34.65 9.55,34.65 9.55,34.45
+5V
  Top 0.15: IC301.6 15.45,31.55 15.85,31.95 C302.P$2
  Top 0.508: C302.P$2 17.05,31.65 17.34,31.65 18.06,30.93 18.06,29.18 17.78,28.9 16.27,28.9 13.69,26.32 Q601.3 13.7,23.34 14.1,22.94 15.64,22.94 18.58,20 23.7,20 24.2,19.5 OP601.8
  pour Top (no thermals): 14.7,31.4 16,31.4 16.1,31.3 17.5,31.3 17.5,32.6 16.14,32.6 15.23,31.69 14.7,31.69
+5V_EN  (via drill 0.3)
  Top 0.127: v19.33,31.2 19.38,31.15 RN801.1 | v12.5,29 12.5,30.16 12.79,30.45 IC301.3
  Top 0.152: IC801.2 22.8,43.15 v22.55,42.9 | v22.5,39.3 19.71,36.51 19.71,31.51 19.38,31.18 RN801.1
  Bottom 0.127: v12.5,29 12.5,28.95 12.88,28.57 16.7,28.57 v19.33,31.2
  Bottom 0.152: v22.55,42.9 22.5,42.85 v22.5,39.3
BAT
  Top 0.508: B1.1 2.5,26.2 3,26.7 SW101.1
CS
  Top 0.152: IC801.9 25.28,38.56 25.78,38.05 27.25,38.05 29,36.3 31.8,36.3 32.3,35.8 34.6,35.8 38.4,32 42.2,32 42.88,31.32 J701.2
  pour Top (no thermals): 41.88,32.02 42.5,31.4 42.5,28.5 43.3,28.5 43.3,31.3 42.58,32.02
GND  (via drill 0.3)  (2 unrouted)
  Top 0.127: C601.P$2 17.81,23.21 v18.5,22.52 | C301.P$1 11.45,30.05 12.4,31 IC301.2
  Top 0.15: IC301.4 15.15,30.45 15.55,30.05 C302.P$1 | 12.76,35.58 12.39,35.95 C202.P$1
  Top 0.152: ICC01.34 57.86,32.56 57.5,32.2 55.6,32.2 55.34,32.46 ICC01.32 55.34,33.76 54.24,34.86 v54.12,34.86 | ICC01.1 55.34,46.24 54.63,45.53 54.63,45.37 54.6,45.34 54.6,45.04 v54.12,44.56 | RN801.8 21.3,30.88 C401.P$2 | 12.76,35.58 13.12,35.58 IC201.4 | IC201.2 15.85,35 C201.P$1 | CA01.P$2 6.97,39.43 v7,39.4 | C102.P$2 20.53,40.39 IC101.4 v19.7,39.7 | IC101.2 15.7,41.34 C101.P$2 v14.45,41.6 | C901B.P$2 41.25,5.5 49.1,5.5 49.3,5.7 ICB01.4
  Top 0.2: v82.62,10.88 82.98,10.88 IC901.4
  Top 0.305: 16.3,5.63 13.37,5.63 12.79,6.21 SV2.5 | v57.03,10.58 57.01,10.6 56.52,10.6 55.96,10.04 CB01.P$2 53.28,10.04 52.66,10.66 18.21,10.66 16.3,8.75 16.3,5.63 | C901B.P$2 40.2,5.63 16.3,5.63 | J101.5 16,44.62 15.44,44.06 C101.P$2
  Top 0.508: R607.1 52.06,59.81 v51.2,58.95 PTC601.1 | v51.75,52.5 51.03,51.78 25.15,51.78 24.33,52.6 CN602.1
  Bottom 0.2: 81.35,10.58 82.32,10.58 v82.62,10.88
  Bottom 0.305: v57.03,10.58 81.35,10.58
  Bottom 0.508: v51.2,58.95 51.2,53.05 v51.75,52.5
  other vias: 32.92,44.13 32.65,39.85 28.66,28.04 28.12,40.83 25.81,42.68 51.4,31.2 46.6,47.74 40.6,46.94 44.1,47.71 36.05,41.16 36.31,36.51 33.4,33.76 24.5,32.06 20.29,35.5 3.53,44.21 26.78,43.75 20.2,31.16 19.82,25.72 23.8,37.36 1.5,48.26 8,48.26 23.22,30.46 22.77,26.86 33.32,22.46 33.32,24.26 33.32,26.86 38.47,28.11 35.77,28.11 33.82,31.26 41.62,43.16 46.82,43.26 19.29,15.76 21.99,15.76 24.09,16.76 22.39,16.76 28.69,15.86 33.19,15.96 43.89,22.36 38.39,22.56 42.84,17.36 47.59,19.26 47.39,23.71 47.59,20.56 37.19,16.86 44.29,28.06 43.39,26.86 34.79,32.36 39.39,33.16 25.75,28.43 26.55,26.93 50.19,16.76 40.29,19.36 46.29,36.96 43.69,41.36 41.49,38.86 51.49,43.36 51.89,37.96 48.69,37.76 45.14,31.98 48.3,25.17 11.29,27.36 7.64,20.51 16.59,20.76 19.99,17.26 22.29,22.86 24.59,21.16 15.79,26.86 51.59,34.76 7.69,18.41 15.79,23.86 18.7,32.31 26.6,37.46 0.79,38.16 1.89,40.46 2.19,29.26 8.89,26.66 1.59,32.56 4.29,31.46 1.89,36.66 7.44,15.01 13.09,15.76 26.39,15.36 17.69,19.66 16.79,17.26 19.29,21.06 41.59,27.06 52.79,30.16 52.79,28.16 50.49,28.36 50.49,30.16 54.3,47.74 21.64,43.76 1.22,22.8 9.11,24.37 5.81,31.37 7.65,36.96 10.6,41.5 12.19,44.86 22.24,45.71 52.19,22.36 14.94,38.56 19.14,38.41 28.84,20.76 24.02,27.61 12.5,33.41 22,37.56 32,47.74 35.9,47.74 46.24,26.66 49.34,34.76 25.4,45.84 26.65,47.04 27.9,48.57 22.9,48.57
  pour Top (rank 2, no thermals): 0.5,48.75 54.73,48.75 54.73,14.5 0.5,14.5
  pour Bottom (rank 2, no thermals): 0.5,48.75 54.73,48.75 54.73,14.5 0.5,14.5
  pour Top (no thermals): 16.3,6.5 17.2,5.6 15.5,5.6 15.4,5.5 15.3,5.5
  pour Top (no thermals): 14.2,42.05 15.15,42.05 15.3,42.2 15.55,42.2 15.65,42.1 15.9,42.1 16,42 16.4,41.6 16.45,41.6 17.7,41.6 17.7,41.1 16.4,41.1 14.2,41.1
GPADI
  Top 0.152: PN801.4 35.4,40.5 35.4,44.03 34.43,45 31.48,45 30.14,43.65 IC801.24
MISO  (via drill 0.3)
  Top 0.152: J701.7 37.38,32.01 34.3,35.09 31.9,35.09 31.4,35.59 28.65,35.59 28.19,36.04 26.68,36.04 23.8,38.92 23.8,39.5 | IC801.7 23.95,40.65 23.8,40.5 23.8,39.5 | RN901.5 v24.58,45.44 | v23.77,39.5 23.8,39.5
  Bottom 0.152: v24.58,45.44 24.14,45 23.85,45 23.2,44.35 23.2,44 23.55,43.65 23.55,39.72 v23.77,39.5
  pour Top (no thermals): 37,28.5 37.7,28.5 37.7,31.1 37.4,31.4 37,31
MOSI  (via drill 0.3)
  Top 0.152: IC801.6 23.85,41.15 23.24,40.54 23.24,38.95 26.51,35.69 28.04,35.69 28.5,35.23 31.26,35.23 31.76,34.73 34.06,34.73 35.8,32.98 v35.8,32.4 | v40.8,31.4 41.4,31.4 41.78,31.02 J701.3
  Bottom 0.152: v35.8,32.4 36.8,31.4 v40.8,31.4
  pour Top (no thermals): 40.6,31.1 41.2,31.1 41.4,30.9 41.4,28.5 42.1,28.5 42.1,31.1 41.6,31.6 40.6,31.6
N$1
  Top 0.508: F101.1 6.04,26.16 5.5,26.7 SW101.2
N$3  (1 unrouted)
  Top 0.508: R604.1 8.55,19.65 4.51,19.65 CN601.4 | CN602.2 21.03,53.83 24.62,53.83 25.75,52.7 50.5,52.7 51.2,53.39 PTC601.2
N$6  (via drill 0.3)
  Top 0.127: IC201.5 12.65,35 v12.58,35.07
  Top 0.152: v12.6,36.79 12.8,36.79 13.2,36.39 13.89,36.39 IC201.8
  Bottom 0.152: v12.58,35.07 12.58,36.79 v12.6,36.79
N$8  (via drill 0.3)
  Top 0.15: IC301.5 15.34,31 v15.42,30.92
  Top 0.152: v15.4,29.2 15.25,29.2 14.9,29.55 14.17,29.55 IC301.8
  Bottom 0.152: v15.42,30.92 15.4,30.9 v15.4,29.2
N$9
  Top 0.152: R804.2 9.9,37.9 10.5,37.3 19.4,37.3 23.75,41.65 IC801.5
N$10
  Top 0.152: D802.1 6.5,42.7 8.3,40.9 R804.1
N$11  (via drill 0.3)
  Top 0.152: OP601.2 OP601.1 24.2,23.91 24.15,23.85 v24.15,23.55 | v25.92,23.8 R802.2
  Bottom 0.152: v24.15,23.55 25.37,23.55 25.62,23.8 v25.92,23.8 25.96,23.84 SJ801.2
  pour Top (no thermals): 25.6,23.9 26,24.3 27.5,24.3 27.5,23.2 26,23.2 25.6,23.6
  pour Top (no thermals): 22.5,24 23.3,24 24,23.3 24.6,23.3 24.6,25.4 22.5,25.4
N$12  (via drill 0.3)
  Top 0.152: ICC01.26 47.83,33.44 47.83,32.63 v48.13,32.33 | v17.8,37.94 12.93,37.94 12.47,38.4 12.47,40.54 13.3,41.37 RC01.2
  Bottom 0.152: v48.13,32.33 48.49,31.98 48.49,27.17 47.12,25.8 33.2,25.8 31.5,27.5 25,27.5 18.5,34 18.5,37.25 v17.81,37.94 v17.8,37.94
N$13
  Top 0.152: RC01.1 11.7,41.6 9.5,43.8 DC01.1
N$15
  Top 0.152: OP601.3 21.63,24.79 R606.2 21.63,27.27 21.4,27.5 17.28,27.5 R605.1
  pour Top (no thermals): 16.5,28.16 17.64,28.16 17.83,27.97 21.73,27.97 22,27.7 22,24 21.3,24 21.3,26.9 20.86,27.34 16.5,27.34
N$16
  Top 0.152: OP601.5 20.28,18.33 18.8,18.33 18.67,18.2 R603.2 15.14,18.39 R602.1
  pour Top (no thermals): 14.7,22 15.6,22 16,21.6 16,19.6 16.5,19.1 20.8,19.1 20.8,17.8 16.3,17.8 15.6,17.1 14.1,17.1 14.1,20.3 14.7,20.9
N$17
  Top 0.152: R604.2 9.4,17.2 R603.3
  pour Top (no thermals): 8.7,17.9 12.4,17.9 12.4,16.5 8.7,16.5
N$18
  Top 0.152: R803.1 13.5,39.12 20.62,39.12 23.65,42.15 IC801.4
N$19
  Top 0.152: 17.07,26.21 R605.2
  Top 0.305: 17.07,26.21 17.47,25.81 C601.P$1 18.19,24.61 21.8,21 23.8,21 25.14,19.66 25.14,17.84 24.7,17.4 23.2,17.4 22.93,17.66 OP601.7 | Q601.1 15.45,25.76 15.9,26.21 R605.2
N$20  (1 unrouted)
  Top 0.152: 9.96,21.24 R601.1
  Top 0.305: R601.1 9.94,21.4
  Top 0.508: 9.94,21.4 2.95,21.4 1.35,19.8 1.35,17.75 2.23,16.87 4.21,16.87 CN601.1 | 9.96,21.24 10.8,20.4 12.6,20.4 13.5,19.5 13.5,17.3 14.3,16.5 20.73,16.5 21.66,17.43 OP601.6
  Bottom 0.508: R607.2 57.68,51.77 50.68,51.77 49.75,52.7 27.51,52.69 25.07,55.15 CN602.3
N$21  (via drill 0.3)
  Top 0.127: 52.5,34.9 52.02,35.38 45.08,35.38 44.58,35.88 44.58,41.44 40.85,45.17 39.33,45.17 38.68,44.52 38.28,44.52
  Top 0.152: ICC01.30 52.84,34.56 52.5,34.9 | 38.28,44.52 36.48,44.52 34.59,46.42 31.1,46.42 v30.75,46.07 | IC801.1 24.29,43.65 v23.78,44.16
  Bottom 0.152: v30.75,46.07 30.3,45.62 30.3,44 29.54,43.24 24.7,43.24 v23.78,44.16
N$22  (via drill 0.3)
  Top 0.127: IC801.15 28.28,38.73 29.05,37.95 v29.5,37.5 | v39.5,34 40.53,34 40.97,34.44 44.73,34.44 45.34,33.82 ICC01.24
  Bottom 0.127: v39.5,34 39,34.5 37,34.5 35.5,36 32.29,36 31.38,36.91 30.09,36.91 v29.5,37.5
N$23  (via drill 0.3)
  Top 0.127: v29.59,38.23 29.49,38.23 28.78,38.94 IC801.16 | v40,34.53 40.59,34.53 40.83,34.77 48.14,34.77 49.09,33.82 ICC01.27
  Bottom 0.127: v40,34.53 39.44,34.53 39.13,34.84 37.13,34.84 34.73,37.24 30.58,37.24 v29.59,38.23
N$24
  Top 0.152: C101.P$1 15.63,40.39 IC101.3 17.92,40.39 18.18,40.65 18.18,41.93 17.82,42.29 IC101.1
  Top 0.305: IC101.1 17.9,42.29 18.6,42.99 J101.1
  pour Top (no thermals): 14.9,40.65 17.9,40.65 18.15,40.9 18.2,40.9 18.2,40.6 17.35,39.75 14.9,39.75
N$25  (via drill 0.3)
  Top 0.152: R802.1 28,25.4 28.1,25.3 C806.P$1 v29,26.5 25.9,29.6 v25.9,32.5 | IC801.12 26.78,38.81 27.03,38.56 v27.42,38.56
  Bottom 0.152: SJ801.1 27.5,26.06 27.94,26.5 v29,26.5 | v25.9,32.5 25.9,32.8 27.7,34.6 27.7,38.28 v27.42,38.56
  pour Top (no thermals): 26.3,24.9 26.4,24.8 29.5,24.8 29.5,26.6 29.3,26.8 28.7,26.8 28.7,26.5 28.3,26.1 26.5,26.1 26.3,25.9
N$30
  Top 0.152: R602.2 R601.2
  Top 0.305: Q601.2 12.75,22.81 11.56,21.62 R601.2
  pour Top (no thermals): 12.4,26.4 13.1,26.4 13.1,22.8 14,21.9 14,20.9 11.1,20.9 11.1,22 12.4,23.3
N$31  (via drill 0.3)
  Top 0.152: v25.55,46.52 25.47,46.6 RN901.6 | v5.63,46.6 5.63,47.45 5.33,47.75 2.72,47.75 2.52,47.55 ICA01.7
  Bottom 0.152: v25.55,46.52 25.53,46.5 7.34,46.5 5.86,45.01 5.41,45.01 5.09,45.33 5.09,45.78 5.63,46.33 v5.63,46.6
N$39
  Top 0.152: D801.1 8,43.12 11.7,39.42 R803.2
N$49  (via drill 0.3)
  Top 0.152: IC801.32 25.28,44.6 25.09,44.79 23.36,44.79 v22.62,44.05 | SW801.1 30.38,21.1 30,21.1 28.6,22.5 26.1,22.5 25.3,23.3 25.3,28.11 24.31,29.1 v24.2,29.1 24.15,29.15 RN801.6
  Bottom 0.152: v22.62,44.05 23.07,43.6 23.07,32.23 24.2,31.1 v24.2,29.1
  pour Top (no thermals): 31.6,20.25 29.6,20.25 29.6,21.45 31.6,21.45
N$50
  Top 0.152: IC801.20 31.25,41.65 31.75,41.15 X801.1 32.95,41.15 33,41.1 C804.P$1
  pour Top (no thermals): 34.55,41.65 34.55,40.55 31.35,40.55 31.35,41.65
N$51
  Top 0.152: IC801.21 31.25,42.15 31.75,42.65 X801.2 32.95,42.65 33,42.7 C805.P$1
  pour Top (no thermals): 34.55,43.25 34.55,42.15 31.35,42.15 31.35,43.25
N$56  (via drill 0.3)
  Top 0.152: RN801.5 21.93,28.6 24.9,25.63 24.9,22.6 26.62,20.88 SWC01.1 27,20.48 27.82,20.48 28.6,19.7 31.8,19.7 33.6,21.5 44.4,21.5 45.6,22.7 v45.6,29.2 | v45.6,30.9 46.48,31.78 53.53,31.78 54.09,32.34 ICC01.31
  Bottom 0.152: v45.6,30.9 v45.6,29.2
N$57
  Top 0.254: ICA01.6 ICA01.5
  pour Top (no thermals): 3.23,47.26 5.04,47.26 5.04,46.55 3.23,46.55
RXD  (via drill 0.3)
  Top 0.152: ICC01.3 52.84,45.44 51.8,44.4 42.1,44.4 40.86,45.65 39.21,45.65 38.46,44.9 36.67,44.9 34.79,46.78 30.73,46.78 29.81,45.85 26.94,45.85 v26.79,45.7 | IC801.31 25.78,45.21 v25.75,45.24
  Bottom 0.152: v26.79,45.7 26.33,45.24 v25.75,45.24
  pour Top (no thermals): 52.4,47.3 53.3,47.3 53.3,45.8 51.87,44.37 51.37,44.37 52.4,45.4
SCK
  Top 0.152: IC801.8 24.53,38.71 26.84,36.4 28.39,36.4 28.85,35.94 31.65,35.94 32.15,35.44 34.45,35.44 38.25,31.64 39.36,31.64 39.58,31.42 J701.5
  pour Top (no thermals): 39.2,28.5 39.2,31.5 39.04,31.66 39.4,31.66 40,31.06 40,28.5
SCL  (via drill 0.3)  (1 unrouted)
  Top 0.152: v31.7,44.49 31.49,44.49 30.15,43.15 IC801.23 | RN901.8 24.8,47.65 25.15,48.01 v25.5,48.01 | v47.5,27.2 47.52,27.2 48.6,26.13 48.61,26.13 51.24,23.5 54.6,23.5 55.4,22.7 55.4,19.85 56.63,18.62 SV1.4 | ICA01.2 2.52,44.15 v2.49,44.11
  Top 0.2: v57.52,9.9 58.02,9.9 58.22,10.1 81.6,10.1 IC901.2 | v46.89,7.12 47.27,7.5 ICB01.2
  Bottom 0.152: v47.5,27.2 47.5,39.3 44.4,42.4 36.9,42.4 36.3,43 36.3,44 35.06,45.24 32.51,45.24 31.77,44.49 v31.7,44.49 31.7,46.6 30.25,48.05 25.55,48.05 v25.5,48.01 24.89,47.4 5.41,47.4 2.49,44.48 v2.49,44.11
  Bottom 0.2: 13.9,7.6 9.18,7.6 SV2.4 | 13.9,7.6 17.3,11 55.02,11 56.12,9.9 v57.52,9.9 | v46.89,7.12 46.57,6.8 14.7,6.8 13.9,7.6
SDA  (via drill 0.3)  (1 unrouted)
  Top 0.152: v46.9,29.6 46.9,25.4 54.08,18.22 SV1.3 | v32.2,43.9 31.5,43.9 30.25,42.65 IC801.22 | v25.55,47.31 25.49,47.31 25.28,47.1 RN901.7 | ICA01.8 1.5,46.88 1.5,46.6 1.9,46.2 4.99,46.2 v5.63,45.56 | SV2.3 10.59,8.77 | v13.53,7.05 13.53,7.1
  Top 0.2: 10.59,8.77 11.88,8.77 13.53,7.1 | v56.02,11.3 57.32,11.3 57.62,11 81.7,11 IC901.1 | v47.6,6.8 49,6.8 49.3,7.1 ICB01.1
  Bottom 0.152: v46.9,29.6 46.9,39.1 43.96,42.04 36.56,42.04 35.8,42.8 35.8,44 34.91,44.88 32.88,44.88 32.2,44.2 v32.2,43.9 31.4,43.9 31.1,44.2 31.1,45.5 31.3,45.7 31.3,46.4 30.05,47.65 25.89,47.65 v25.55,47.31 25.2,46.96 7.03,46.96 v5.63,45.56
  Bottom 0.2: v13.53,7.05 14.32,6.25 47.05,6.25 v47.6,6.8 | v56.02,11.3 55.62,11.3 55.42,11.5 17,11.5 14.25,8.75 SV2.3
  pour Top (no thermals): 1.05,47.3 1.85,47.3 1.85,46.35 1.95,46.25 1.95,46.17 1.38,46.17 1.05,46.5
SLEEP  (via drill 0.3)
  Top 0.152: v29.5,44.32 29.42,44.4 IC801.25 | ICC01.9 45.34,47.51 44.59,48.26 30.97,48.26 v29.6,46.89
  Bottom 0.152: v29.5,44.32 29.9,44.72 29.9,46.59 v29.6,46.89
TXD  (via drill 0.3)
  Top 0.152: ICC01.4 51.59,45.59 51,45 v50,45 | IC801.30 26.28,45.92 26.57,46.21 29.65,46.21 30.58,47.14 39.28,47.14 v39.31,47.12
  Bottom 0.152: v50,45 41.42,45 v39.31,47.12
  pour Top (no thermals): 51.2,47.3 52,47.3 52,45.6 51.38,44.98 50.48,44.98 51.2,45.7
UPID
  Top 0.152: PN801.2 37.01,43.48 34.43,46.06 31.49,46.06 30.92,45.49 28.2,45.49 27.78,45.07 IC801.27
USB  (via drill 0.3)
  Top 0.508: C102.P$1 19.96,42.55 IC101.5 v19.7,41.5
  Bottom 0.508: v19.7,41.5 15.8,37.6 11.16,37.6 8.8,35.23 8.8,28.7 SW101.3
VBAT  (via drill 0.3)
  Top 0.127: IC201.1 15.25,34.45 15.6,34.1 15.6,33.78 15.54,33.72 | v15.56,36.12 15.56,35.77 15.34,35.55 IC201.3 | IC301.1 12.5,32.2 12.5,32.22
  Top 0.152: 21.35,34.5 IC401.3 C401.P$1 | 12.5,32.22 12.5,32.28
  Top 0.254: 21.35,34.5 v22.3,34.5 v22.3,36.2 22.05,36.45 IC401.1
  Top 0.305: C301.P$2 11.68,32.28 12.5,32.28 IC301.7 IC201.7 15.54,33.72 16.42,33.72 C201.P$2 16.85,34 v17.96,34 18.9,34 v19.1,34.2
  Top 0.508: C301.P$2 11.27,31.92 8.6,31.92 | 8.6,31.92 6.77,30.09 6.77,27.13 7.67,26.23 F101.2 | 8.6,31.92 8.6,32.41 D101.1
  Bottom 0.127: v17.96,34 16.6,34 15.56,35.04 v15.56,36.12
  Bottom 0.508: v19.1,34.2 22,34.2 v22.3,34.5
  pour Top (no thermals): 20.7,33.9 22,33.9 22.8,34.7 22.8,36.1 22.2,36.7 20.7,36.7 20.7,36.2 22.1,36.2 22.2,36.1 22.2,34.9 22.1,34.8 20.7,34.8
  pour Top (no thermals): 20.7,34.8 20.7,32.6 20.8,32.5 21.9,32.5 22,32.6 22,34.8
  pour Top (no thermals): 10.5,32.6 12.2,32.6 13,33.4 13,34 14.7,34 14.7,34.6 16,34.6 16.1,34.7 19.2,34.7 19.4,34.5 19.4,33.7 19,33.3 15.8,33.3 15.1,32.6 15.1,32 13.3,32 13.3,31.4 12.2,31.4 12.1,31.3 10.5,31.3
  pour Top (no thermals): 6,35 7.75,35 10.15,32.6 10.5,32.6 10.5,31.3 8.25,31.3 6.95,30 6.55,30 6.55,32.6 6,33.15

### Text on the board
tPlace: MLS01-TG000-C09 Lot:2501 | GND | - | BAT | USB | + | MLS01-TG000-C09 / Lot:2501(A) | Cx | Rst | VEL | MLS01-TG000-C09 Lot:2501 | CO2
_tNames: R607 | CN602 | PTC601 | J101 | RN901 | C803 | X801 | PN801 | ICC01 | D802 | D801 | DC01 | IC801 | C805 | ICA01 | C101 | RC01 | C804 | CA01 | R804 | R803 | C102 | IC101 | C807 | C802 | IC201 | C201 | D101 | CC01 | C202 | C401 | C302 | C301 | IC401 | J701 | C402 | IC301 | OP601 | C701 | Q601 | RN801 | R802 | R606 | R605 | B1 | C601 | C806 | SW101 | F101 | R601 | R602 | CN601 | R604 | R603 | SWC01 | SW801 | SV1 | IC901 | CB01 | C901B | SV2 | ICB01
_bNames: SJ801